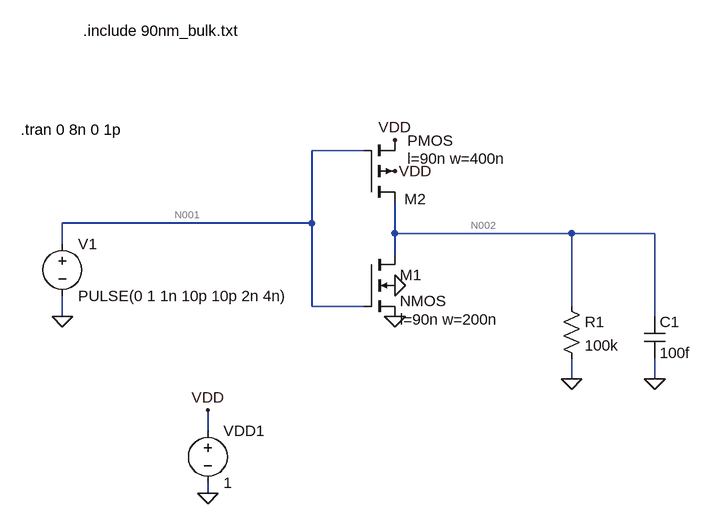
[diagram p0: schematic test.asc]
test.asc, the LTspice schematic file:
Version 4
SHEET 1 880 740
WIRE -80 192 -160 192
WIRE -160 304 -160 192
WIRE -160 304 -544 304
WIRE -32 320 -32 272
WIRE 240 320 -32 320
WIRE 368 320 240 320
WIRE -544 336 -544 304
WIRE -32 352 -32 320
WIRE -160 432 -160 304
WIRE -80 432 -160 432
WIRE 240 432 240 320
WIRE -544 448 -544 416
WIRE 368 448 368 320
WIRE 240 544 240 512
WIRE 368 544 368 512
WIRE -320 624 -320 592
WIRE -320 720 -320 704
FLAG -320 592 VDD
FLAG 240 544 0
FLAG 368 544 0
FLAG -32 400 0
FLAG -544 448 0
FLAG -32 224 VDD
FLAG -32 448 0
FLAG -32 176 VDD
FLAG -320 720 0
SYMBOL nmos4 -80 352 R0
WINDOW 123 56 100 Left 2
SYMATTR InstName M1
SYMATTR Value2 l=90n w=200n
SYMBOL pmos4 -80 272 M180
WINDOW 0 63 5 Left 2
WINDOW 3 67 95 Left 2
WINDOW 123 67 67 Left 2
SYMATTR InstName M2
SYMATTR Value2 l=90n w=400n
SYMBOL voltage -544 320 R0
WINDOW 123 0 0 Left 2
WINDOW 39 0 0 Left 2
SYMATTR InstName V1
SYMATTR Value PULSE(0 1 1n 10p 10p 2n 4n)
SYMBOL voltage -320 608 R0
WINDOW 123 0 0 Left 2
WINDOW 39 0 0 Left 2
SYMATTR InstName VDD1
SYMATTR Value 1
SYMBOL res 224 416 R0
SYMATTR InstName R1
SYMATTR Value 100k
SYMBOL cap 352 448 R0
SYMATTR InstName C1
SYMATTR Value 100f
TEXT -512 8 Left 2 !.include 90nm_bulk.txt
TEXT -608 160 Left 2 !.tran 0 8n 0 1p

The netlist it stands for:
* test.asc
M1 N002 N001 0 0 NMOS l=90n w=200n
M2 N002 N001 VDD VDD PMOS l=90n w=400n
V1 N001 0 PULSE(0 1 1n 10p 10p 2n 4n)
VDD1 VDD 0 1
R1 N002 0 100k
C1 N002 0 100f
.model NMOS NMOS
.model PMOS PMOS
.lib standard.mos
.include 90nm_bulk.txt
.tran 0 8n 0 1p
.backanno
.end

* Results of the author's LTspice run, read from the files saved beside the schematic
* Operating Point, zero values left out:
*   V(n002) = 972.5 mV
*   V(vdd) = 1 V
*   Id(M2) = -9.73 µA
*   Ig(M2) = -2.738 pA
*   Is(M2) = 9.73 µA
*   Id(M1) = 4.875 nA
*   Ig(M1) = -107.7 pA
*   Is(M1) = -4.766 nA
*   I(R1) = 9.725 µA
*   I(Vdd1) = -9.73 µA
*   I(V1) = 110.4 pA
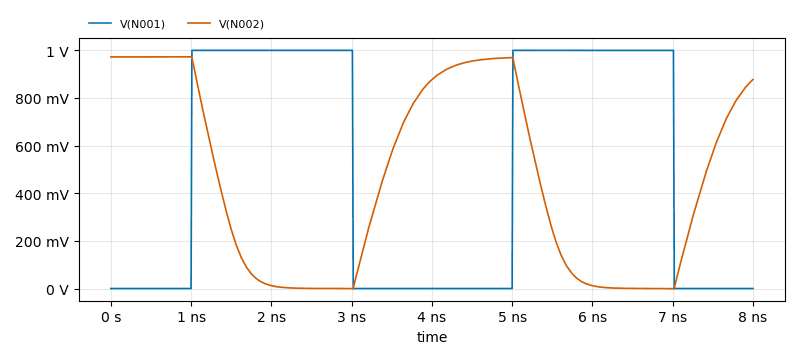
[diagram p1: Transient Analysis of test.asc, plotted from the saved traces]
* Transient Analysis, 1 run:
*   V(N001): min 0 V, max 1 V, average 502.5 mV, rms 708.3 mV, last 0 V
*   V(N002): min -1.184 mV, max 974 mV, average 455.6 mV, rms 607.4 mV, last 877.4 mV